# Altium project AT1614 Dev Board.PrjPcb
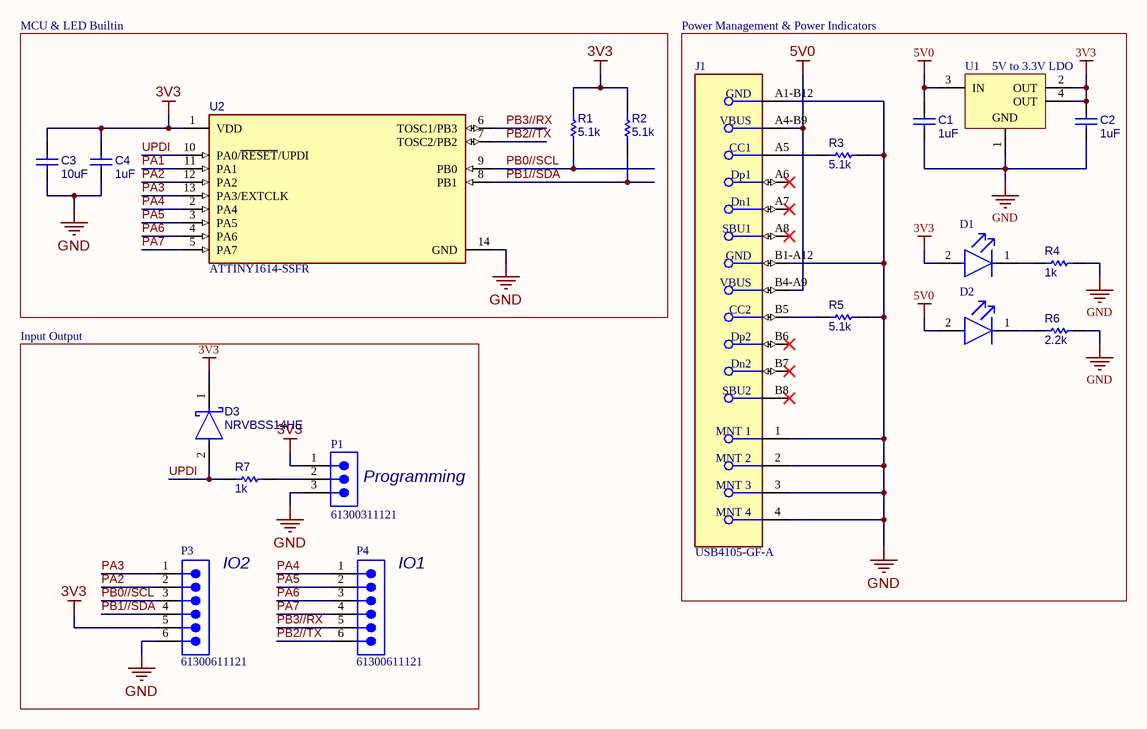
[diagram p0: Main.SchDoc]
1 sheet, 20 parts. Net scope: global (net labels, ports and power ports of the same name join across sheets).
Board file: Main.PcbDoc

## Sheet Main.SchDoc
size A0; SheetNumber: 1; SheetTotal: 1

### Parts
C1  1uF  [WCAP-CSGP_0603_L1.6W0.8H0.8_Reflow]
C2  1uF  [WCAP-CSGP_0603_L1.6W0.8H0.8_Reflow]
C3  10uF  [WCAP-CSGP_0603_L1.6W0.8H0.8_Reflow]
C4  1uF  [WCAP-CSGP_0603_L1.6W0.8H0.8_Reflow]
D1  LTST-C190KGKT  [FP-LTST-C190KGKT-MFG]  (value not drawn)
D2  LTST-C190KGKT  [FP-LTST-C190KGKT-MFG]  (value not drawn)
D3  NRVBSS14HE  [FP-477AD-MFG]
J1  USB4105-GF-A  [FP-USB4105-GF-A-MFG]
P1  61300311121  [61300311121]
P3  61300611121  [61300611121]
P4  61300611121  [61300611121]
R1  5.1k  [RESC1608X55X25NL10T15]
R2  5.1k  [RESC1608X55X25NL10T15]
R3  5.1k  [RESC1608X55X25NL10T15]
R4  1k  [RESC1608X55X25NL10T15]
R5  5.1k  [RESC1608X55X25NL10T15]
R6  2.2k  [RESC1608X55X25NL10T15]
R7  1k  [RESC1608X55X25NL10T15]
U1  TLV1117LV33DCYR  [DCY0004A_N]  (value not drawn)
U2  ATTINY1614-SSFR  [FP-C04-065-D3X-MFG]

### Blocks framed on the sheet
MCU & LED Builtin: C3 C4 R1 R2 U2

### Nets
3V3: C2.2 C3.2 C4.2 D1.2(A) D3.1(C) P1.1 P3.5 R1.1 R2.1 U1.2(OUT) U1.4(OUT) U2.1(VDD)
5V0: C1.2 D2.2(A) J1.A4-B9(VBUS) J1.B4-A9(VBUS) U1.3(IN)
GND: C1.1 C2.1 C3.1 C4.1 J1.1(MNT_1) J1.2(MNT_2) J1.3(MNT_3) J1.4(MNT_4) J1.A1-B12(GND) J1.B1-A12(GND) P1.3 P3.6 R3.2 R4.2 R5.2 R6.2 U1.1(GND) U2.14(GND)
PA1: U2.11(PA1)
PA2: P3.2 U2.12(PA2)
PA3: P3.1 U2.13(PA3/EXTCLK)
PA4: P4.1 U2.2(PA4)
PA5: P4.2 U2.3(PA5)
PA6: P4.3 U2.4(PA6)
PA7: P4.4 U2.5(PA7)
PB0//SCL: P3.3 R1.2 U2.9(PB0)
PB1//SDA: P3.4 R2.2 U2.8(PB1)
PB2//TX: P4.6 U2.7(TOSC2/PB2)
PB3//RX: P4.5 U2.6(TOSC1/PB3)
UPDI: D3.2(A) R7.1 U2.10(PA0/~{RESET}/UPDI)
NetD1_1: D1.1(C) R4.1
NetD2_1: D2.1(C) R6.1
NetJ1_A5: J1.A5(CC1) R3.1
NetJ1_B5: J1.B5(CC2) R5.1
NetP1_2: P1.2 R7.2

Not connected (* = marked no-connect by the designer): J1 A6(Dp1)* A7(Dn1)* A8(SBU1)* B6(Dp2)* B7(Dn2)* B8(SBU2)*

### Notes on the sheet
- Power Management & Power Indicators
- (near U1) 5V to 3.3V LDO
- Input Output
- (near P1) Programming
- (near P3) IO2
- (near P4) IO1

### Library data of the parts
C1-C4 = CMP-207839-000060-3: 10V tolerance
D1 D2 = CMP-2000-05197-2: LED GREEN CLEAR CHIP SMD; Test Current: 20mA; Power Rating: 75mW; Forward Voltage: 2V; Wavelength: 574nm; Number of LEDs: 1; Reverse Voltage: 5V; Dominant Wavelength: 571nm; Lens Style: Diffused; Luminous Intensity: 35mcd; Forward Current: 30mA; Viewing Angle: 130°; Lens Color: Colorless; Width: 0.8mm; Case Code (Imperial): 0603; Case Code (Metric): 1608; Number of Pins: 2; Radiation Hardening: No; Package Quantity: 1; Lead Free: Lead Free; Lens Transparency: Clear; Depth: 0.8mm; Power Dissipation: 75mW; Mount: Surface Mount; Max Operating Temperature: 85°C; Case/Package: 0603; Height: 0.8mm; Illumination Color: Green; Color: Green; Length: 1.6mm; Packaging: Tape and Reel; Number of Elements: 1; Min Operating Temperature: -55°C
D3 = CMP-00278-93203856-2: NRVBSS14HE Rectifier Diode, Schottky, 1 Phase, 1 Element, 1A, 40V V(RRM), Silicon; Manufacturer Lifecycle Status: ACTIVE; Capacitance: 55pF; Max Forward Surge Current (Ifsm): 25A; Peak Reverse Current: 5µA; Max Junction Temperature (Tj): 150°C; Forward Current: 1A; Min Operating Temperature: -55°C; NexarPartId: 93203856; Reverse Voltage: 40V; Max Operating Temperature: 150°C; RoHS: Compliant; Lifecycle Status: Production; Max Repetitive Reverse Voltage (Vrrm): 40V; Height: 750µm
J1 = CMP-245163-000001-1: CONN RCPT USB2.0 TYPEC 5A; Manufacturer: GCT; Voltage Rating: 20V; Is Female: yes; Current Rating: 5/6.25/1.25/0.25A; Number Of Contacts: 16; Conn Orientation: Right Angle; Device Class L1: Connectors; Category: Conn; Lead Free: Yes; RoHS: TRUE; Temperature Range High: +85°C; Digikey Description: CONN RCPT USB2.0 TYPEC 5A; Device Class L3: unset; ComponentLink2Description: Datasheet; Manufacturer Part Number: USB4105-GF-A; Package: 0; Usb Standard: USB 2.0; Device Class L2: USB Connectors; Automotive: No; Temperature Range Low: -40°C; Height: 3.46mm; Temperature: -40°C to +85°C; Contact Material: Gold,Nickel; ComponentLink2URL: https://gct.co/files/drawings/usb4105.pdf; Octopart: https://octopart.com/usb4105-gf-a-gct-106627878
P1 = CMP-1502-01062-4: THT Vertical Pin Header WR-PHD, Pitch 2.54 mm, Single Row, 3 pins; Connector Type: Male Pin; Number of Contacts: 3; Operating Supply Voltage: 250V; Current Rating: 3A; Pitch: 2.54mm; Contact Resistance: 20mΩ; Gender: Male; Height: 8.94mm; Color: Black; Min Operating Temperature: -40°C; Max Operating Temperature: 105°C; Mount: Through Hole; Termination: Solder; Number of Rows: 1; Packaging: Bulk; Number of Pins: 3; Lead Pitch: 2.54mm; RoHS: Compliant; Contact Plating: Gold; Number of Positions: 3; Lead Free: Lead Free; Voltage Rating: 250V; Contact Mating Length: 5.9944mm; Orientation: Vertical; Contact Material: Gold
P3 P4 = CMP-1502-01070-3: NexarPartId: 20084590; Current Rating: 3A; Pitch: 2.54mm; Gender: Male; Operating Supply Voltage: 250V; Connector Type: Male Pin; Number of Positions: 6; Contact Resistance: 20mΩ; Packaging: Bulk; Number of Pins: 6; Number of Rows: 1; Contact Plating: Gold; Lead Free: Lead Free; RoHS: Compliant; Contact Mating Length: 5.9944mm; Voltage Rating: 250V; REACH SVHC: Unknown; Contact Gender: Male; Housing Material: PBT; Min Operating Temperature: -40°C; Lead Pitch: 2.54mm; Mount: Through Hole; Number of Contacts: 6; Max Operating Temperature: 105°C; Contact Material: Copper; Orientation: Vertical; Termination: Through Hole; Color: Black; Height: 8.89mm
R1-R7 = CMP-2000-04186-1
U1 = CMP-0395-00503-2: Single Output LDO, 1 A, Fixed 3.3 V Output, 2 to 5.5 V Input, 4-pin SOT-223 (DCY), -40 to 125 degC, Green (RoHS & no Sb/Br); Manufacturer: Texas Instruments; Vout Adj(Min)(V): 3.3; Vdo(Typ)(mV): 1200; Iq(Typ)(mA): 0.05; Accuracy(%): 2; Iout(Max)(A): 1; SubFamily: Single Channel LDO; Vin(Max)(V): 5.5; PackageReference: DCY0004A; PackageDescription: 4-Pin Plastic Small Outline, Body 3.5 x 6.5 mm, Pitch 2.3 mm; Vout Adj(Max)(V): 3.3; Mounting Technology: Surface Mount; ComponentLink2Description: Datasheet; ComponentLink1Description: Manufacturer URL; PartNumber: TLV1117LV33DCYR; ComponentLink3Description: Package Specification; ComponentLink1URL: http://www.ti.com/; ComponentLink2URL: http://www.ti.com/general/docs/lit/getliterature.tsp?genericPartNumber=TLV1117LV33&fileType=pdf; Fixed Output Options(V): 3.3; PackageVersion: 4202506/B; Vin(Min)(V): 2; DatasheetVersion: SBVS160A; Eco-Plan: Green (RoHS & no Sb/Br); ComponentLink3URL: http://www.ti.com/litv/pdf/mpds094a; Code_JEDEC: TO-261
U2 = CMP-06276-000021-1: IC MCU 8BIT 16KB FLASH 14SOIC; Manufacturer: Microchip; Number Of A/D Converters: 2; Number Of Uart Channels: 1; Min Supply Voltage: 1.8V; Interface: I2C,SPI,UART,USART,2-Wire,LIN,IrDA; Memory Size: 16KBytes; Core Architecture: AVR; Nominal Supply Current: 2.6-10200uA; Data Bus Width: 8bits; Max Supply Voltage: 5.5V; Number Of I/Os: 12; Standoff Height: 0.1mm; Number Of Adc Channels: 14; Ram Size: 2KBytes; Number Of Timers/Counters: 5; Frequency: 16MHz; Temperature Range High: +125°C; Device Class L3: Microcontrollers; Number Of Cores: 1; Temperature Range Low: -40°C; Ipc Land Pattern Name: SOIC127P600X175-14; Height: 1.75mm; Category: IC; Number Of Pwm Channels: 1; Manufacturer Part Number: ATTINY1614-SSFR; Device Class L2: Embedded Processors and Controllers; ComponentLink2Description: Datasheet; Device Class L1: Integrated Circuits (ICs); Number Of Spi Channels: 1; Lead Free: Yes; Digikey Description: IC MCU 8BIT 16KB FLASH 14SOIC; Number Of I2C Channels: 1; Memory Type: FLASH; ComponentLink2URL: http://ww1.microchip.com/downloads/en/DeviceDoc/ATtiny1614-DataSheet-DS40001995B.pdf; RoHS: TRUE; Package: C04-065-D3X; Temperature: -40°C to +125°C; Mouser Description: 8-Bit AVR Microcontroller 16Kbyte Flash 2Kbyte SRAM 14-Pin SOIC T/R; Automotive: No; Octopart: https://octopart.com/attiny1614-ssfr-microchip-82181131